# EAGLE schematic micro_ir_led (EAGLE 9.0.1)
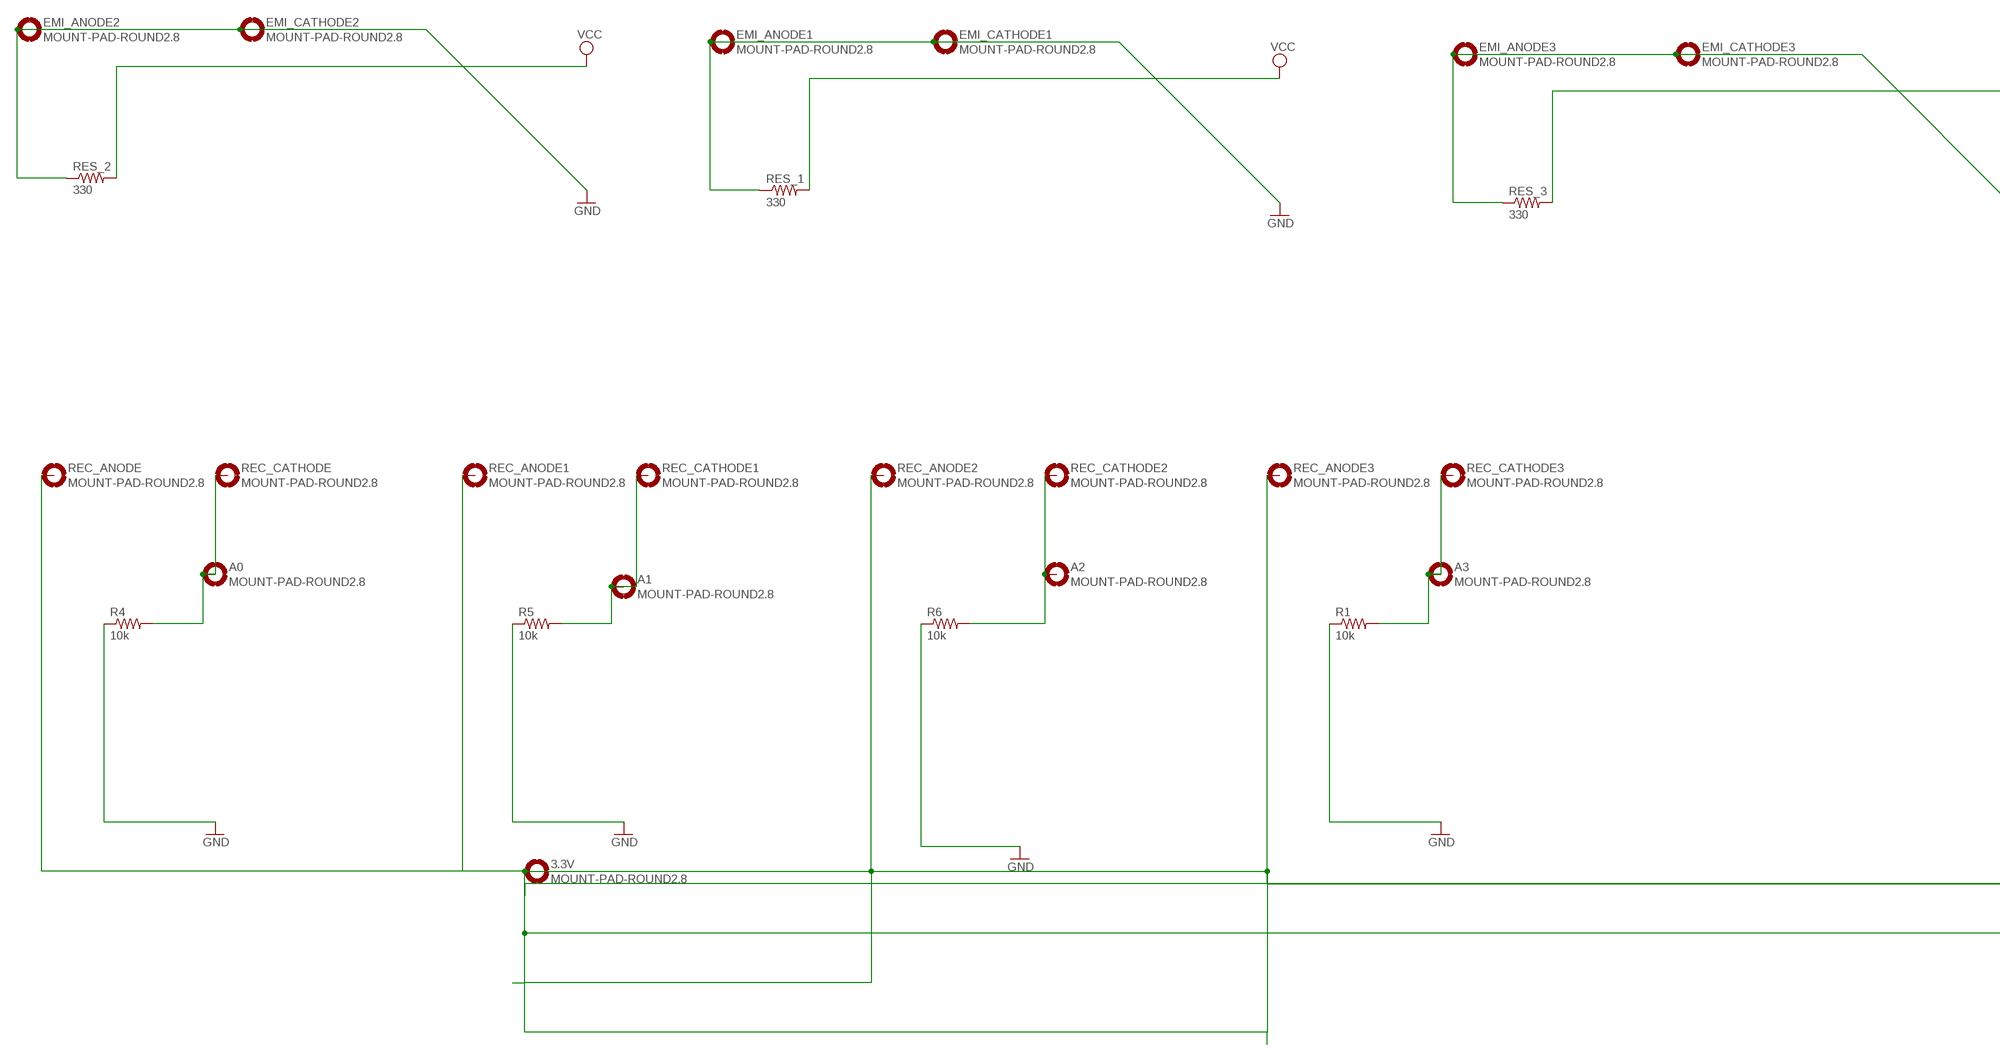
[diagram p0: schematic, sheet 1, part 1 of 2]
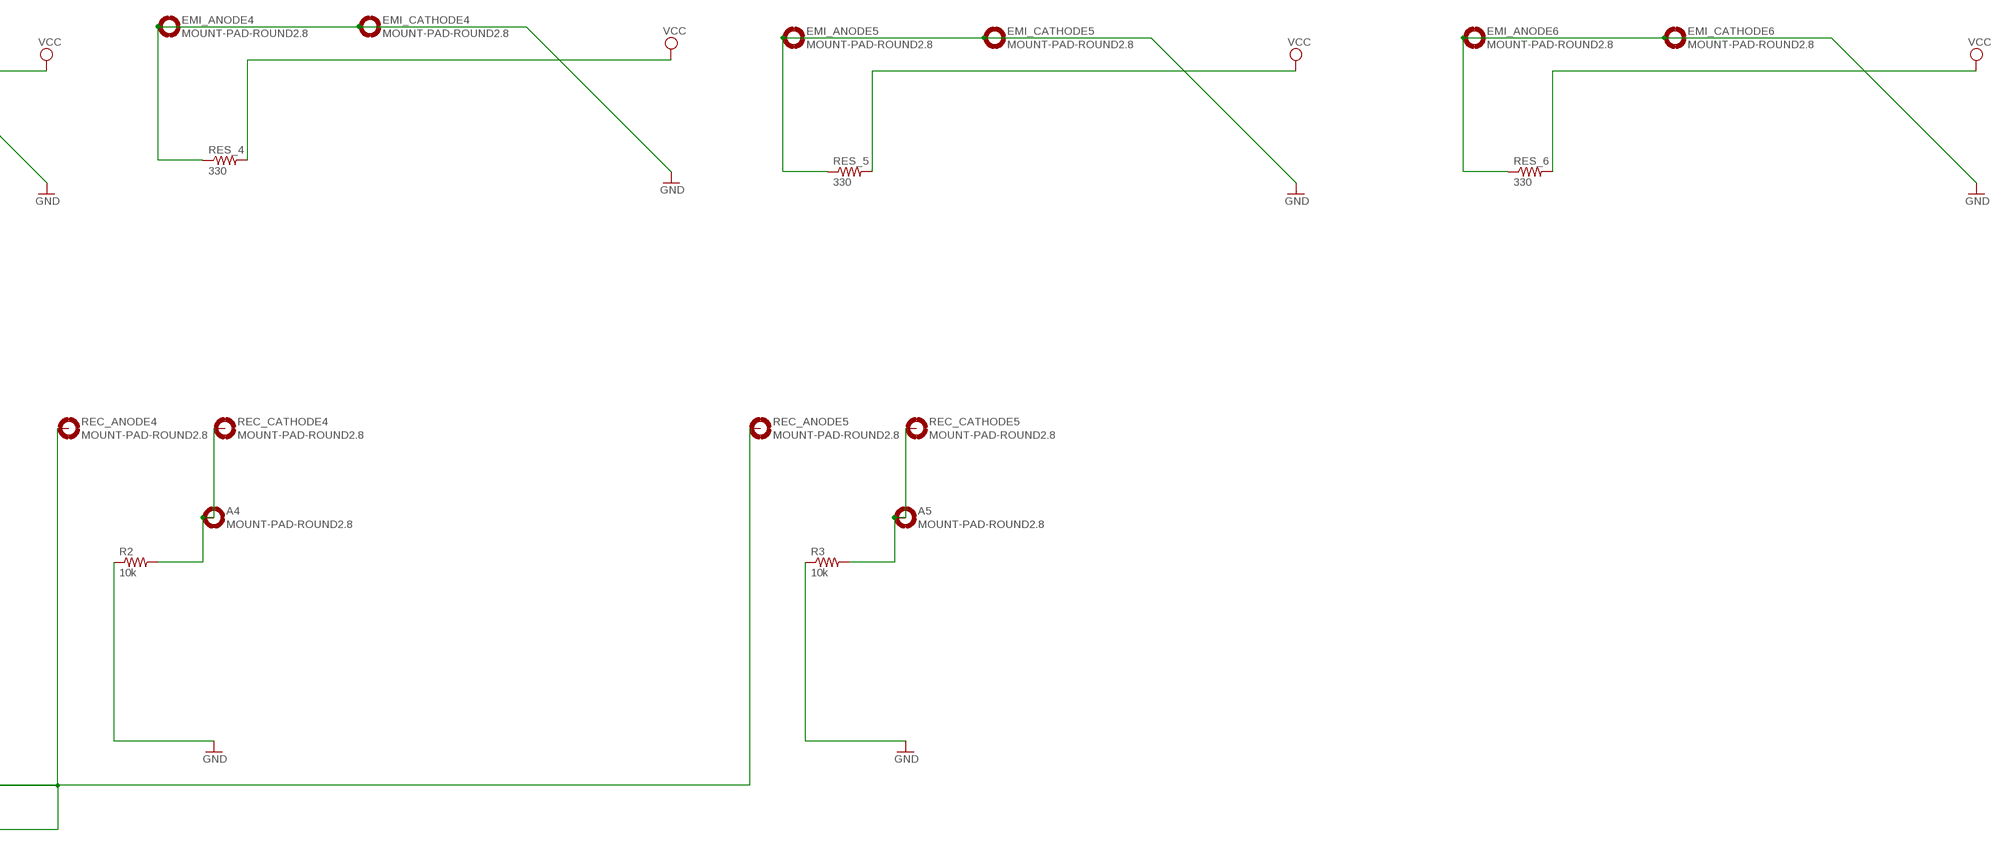
[diagram p1: schematic, sheet 1, part 2 of 2]

## Parts
3.3V  MOUNT-PAD-ROUND2.8  [2,8-PAD]
A0  MOUNT-PAD-ROUND2.8  [2,8-PAD]
A1  MOUNT-PAD-ROUND2.8  [2,8-PAD]
A2  MOUNT-PAD-ROUND2.8  [2,8-PAD]
A3  MOUNT-PAD-ROUND2.8  [2,8-PAD]
A4  MOUNT-PAD-ROUND2.8  [2,8-PAD]
A5  MOUNT-PAD-ROUND2.8  [2,8-PAD]
EMI_ANODE1  MOUNT-PAD-ROUND2.8  [2,8-PAD]
EMI_ANODE2  MOUNT-PAD-ROUND2.8  [2,8-PAD]
EMI_ANODE3  MOUNT-PAD-ROUND2.8  [2,8-PAD]
EMI_ANODE4  MOUNT-PAD-ROUND2.8  [2,8-PAD]
EMI_ANODE5  MOUNT-PAD-ROUND2.8  [2,8-PAD]
EMI_ANODE6  MOUNT-PAD-ROUND2.8  [2,8-PAD]
EMI_CATHODE1  MOUNT-PAD-ROUND2.8  [2,8-PAD]
EMI_CATHODE2  MOUNT-PAD-ROUND2.8  [2,8-PAD]
EMI_CATHODE3  MOUNT-PAD-ROUND2.8  [2,8-PAD]
EMI_CATHODE4  MOUNT-PAD-ROUND2.8  [2,8-PAD]
EMI_CATHODE5  MOUNT-PAD-ROUND2.8  [2,8-PAD]
EMI_CATHODE6  MOUNT-PAD-ROUND2.8  [2,8-PAD]
R1  10k  R-US_0204/2V  [0204V]
R2  10k  R-US_0204/2V  [0204V]
R3  10k  R-US_0204/2V  [0204V]
R4  10k  R-US_0204/2V  [0204V]
R5  10k  R-US_0204/2V  [0204V]
R6  10k  R-US_0204/2V  [0204V]
REC_ANODE  MOUNT-PAD-ROUND2.8  [2,8-PAD]
REC_ANODE1  MOUNT-PAD-ROUND2.8  [2,8-PAD]
REC_ANODE2  MOUNT-PAD-ROUND2.8  [2,8-PAD]
REC_ANODE3  MOUNT-PAD-ROUND2.8  [2,8-PAD]
REC_ANODE4  MOUNT-PAD-ROUND2.8  [2,8-PAD]
REC_ANODE5  MOUNT-PAD-ROUND2.8  [2,8-PAD]
REC_CATHODE  MOUNT-PAD-ROUND2.8  [2,8-PAD]
REC_CATHODE1  MOUNT-PAD-ROUND2.8  [2,8-PAD]
REC_CATHODE2  MOUNT-PAD-ROUND2.8  [2,8-PAD]
REC_CATHODE3  MOUNT-PAD-ROUND2.8  [2,8-PAD]
REC_CATHODE4  MOUNT-PAD-ROUND2.8  [2,8-PAD]
REC_CATHODE5  MOUNT-PAD-ROUND2.8  [2,8-PAD]
RES_1  330  R-US_0204/2V  [0204V]
RES_2  330  R-US_0204/2V  [0204V]
RES_3  330  R-US_0204/2V  [0204V]
RES_4  330  R-US_0204/2V  [0204V]
RES_5  330  R-US_0204/2V  [0204V]
RES_6  330  R-US_0204/2V  [0204V]

## Nets
GND: EMI_ANODE1.B2,8(MOUNT) EMI_ANODE2.B2,8(MOUNT) EMI_ANODE3.B2,8(MOUNT) EMI_ANODE4.B2,8(MOUNT) EMI_ANODE5.B2,8(MOUNT) EMI_ANODE6.B2,8(MOUNT) EMI_CATHODE1.B2,8(MOUNT) EMI_CATHODE2.B2,8(MOUNT) EMI_CATHODE3.B2,8(MOUNT) EMI_CATHODE4.B2,8(MOUNT) EMI_CATHODE5.B2,8(MOUNT) EMI_CATHODE6.B2,8(MOUNT) R1.1 R2.1 R3.1 R4.1 R5.1 R6.1 RES_1.1 RES_2.1 RES_3.1 RES_4.1 RES_5.1 RES_6.1
N$1: REC_ANODE5.B2,8(MOUNT)
N$2: 3.3V.B2,8(MOUNT) REC_ANODE1.B2,8(MOUNT) REC_ANODE2.B2,8(MOUNT) REC_ANODE3.B2,8(MOUNT) REC_ANODE4.B2,8(MOUNT) REC_ANODE.B2,8(MOUNT)
N$3: A0.B2,8(MOUNT) R4.2 REC_CATHODE.B2,8(MOUNT)
N$4: A1.B2,8(MOUNT) R5.2 REC_CATHODE1.B2,8(MOUNT)
N$5: A2.B2,8(MOUNT) R6.2 REC_CATHODE2.B2,8(MOUNT)
N$6: A3.B2,8(MOUNT) R1.2 REC_CATHODE3.B2,8(MOUNT)
N$7: A4.B2,8(MOUNT) R2.2 REC_CATHODE4.B2,8(MOUNT)
N$8: A5.B2,8(MOUNT) R3.2 REC_CATHODE5.B2,8(MOUNT)
VCC: RES_1.2 RES_2.2 RES_3.2 RES_4.2 RES_5.2 RES_6.2

## Library data of the parts
3.3V A0 A1-A5 EMI_ANODE1-EMI_ANODE6 EMI_CATHODE1-EMI_CATHODE6 REC_ANODE REC_ANODE1-REC_ANODE5 REC_CATHODE REC_CATHODE1-REC_CATHODE5 = holes:MOUNT-PAD-ROUND: MOUNTING PAD, round
R1-R6 = resistor:R-US_: RESISTOR, American symbol
RES_1-RES_6 = rcl:R-US_: RESISTOR, American symbol; SPICEPREFIX: R